# EAGLE design CANSplitter (EAGLE 9.6.2)
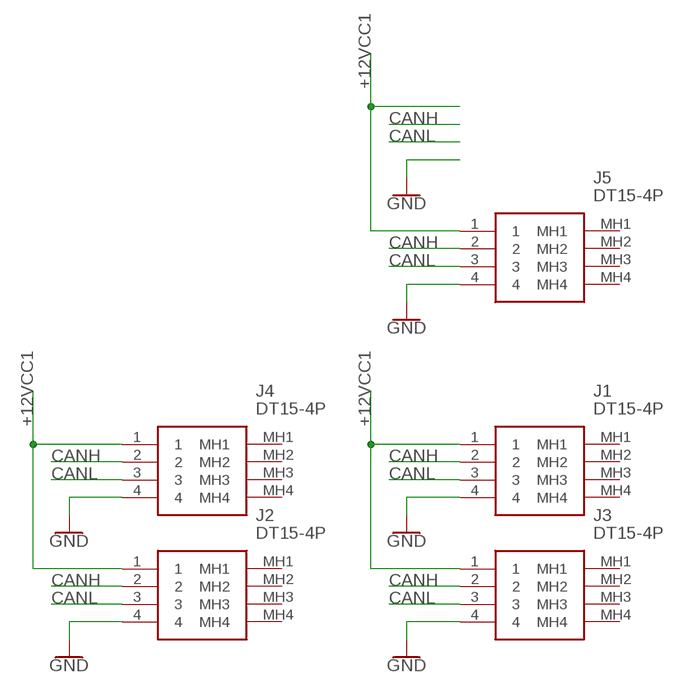
[diagram p0: schematic, sheet 1]

## Parts
J1  DT15-4P  [DT154P]
J2  DT15-4P  [DT154P]
J3  DT15-4P  [DT154P]
J4  DT15-4P  [DT154P]
J5  DT15-4P  [DT154P]

## Nets
+12VCC1: J1.1 J2.1 J3.1 J4.1 J5.1
CANH: J1.2 J2.2 J3.2 J4.2 J5.2
CANL: J1.3 J2.3 J3.3 J4.3 J5.3
GND: J1.4 J2.4 J3.4 J4.4 J5.4
Unconnected: J1.MH1 J1.MH2 J1.MH3 J1.MH4 J2.MH1 J2.MH2 J2.MH3 J2.MH4 J3.MH1 J3.MH2 J3.MH3 J3.MH4 J4.MH1 J4.MH2 J4.MH3 J4.MH4 J5.MH1 J5.MH2 J5.MH3 J5.MH4

## Library data of the parts
J1-J5 = DT15-4P:DT15-4P: Deutsch DT15 Series, 4.44mm Pitch 4 Way 2 Row Straight PCB Header, Solder Termination Source: Datasheet <https://www.te.com/commerce/DocumentDelivery/DDEController?Action=showdoc&DocId=Customer DrawingDT15-4PD2pdfEnglishENG_CD_DT15-4P_D2.pdfDT15-4P>; DESCRIPTION: Deutsch DT15 Series, 4.44mm Pitch 4 Way 2 Row Straight PCB Header, Solder Termination; HEIGHT: 30.35mm; MANUFACTURER_NAME: TE Connectivity; MANUFACTURER_PART_NUMBER: DT15-4P; MOUSER_PART_NUMBER: 571-DT15-4P; MOUSER_PRICE-STOCK: https://www.mouser.co.uk/ProductDetail/TE-Connectivity-DEUTSCH/DT15-4P?qs=vkMqrgFpRajtjo1r4fVe%2Fw%3D%3D

## Net classes
0 default: width 0.305 mm

## Board
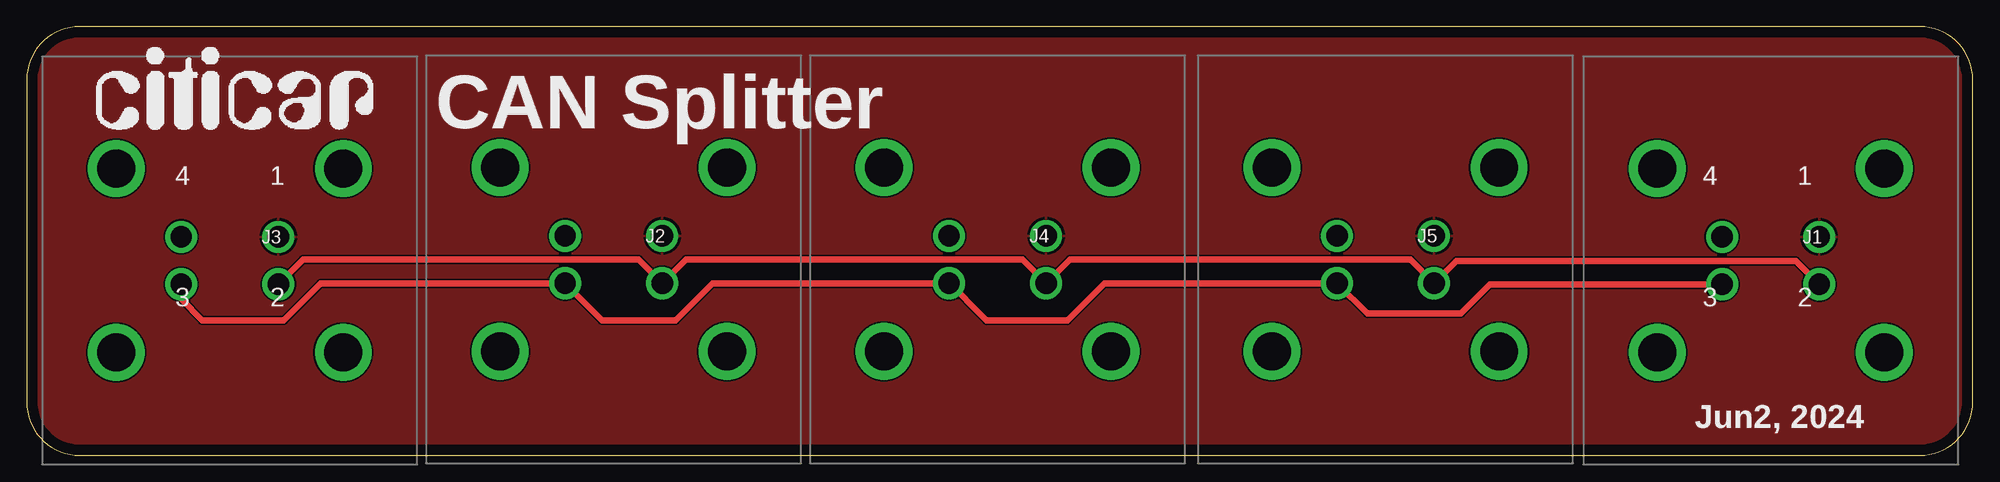
[diagram p1: board, top side]
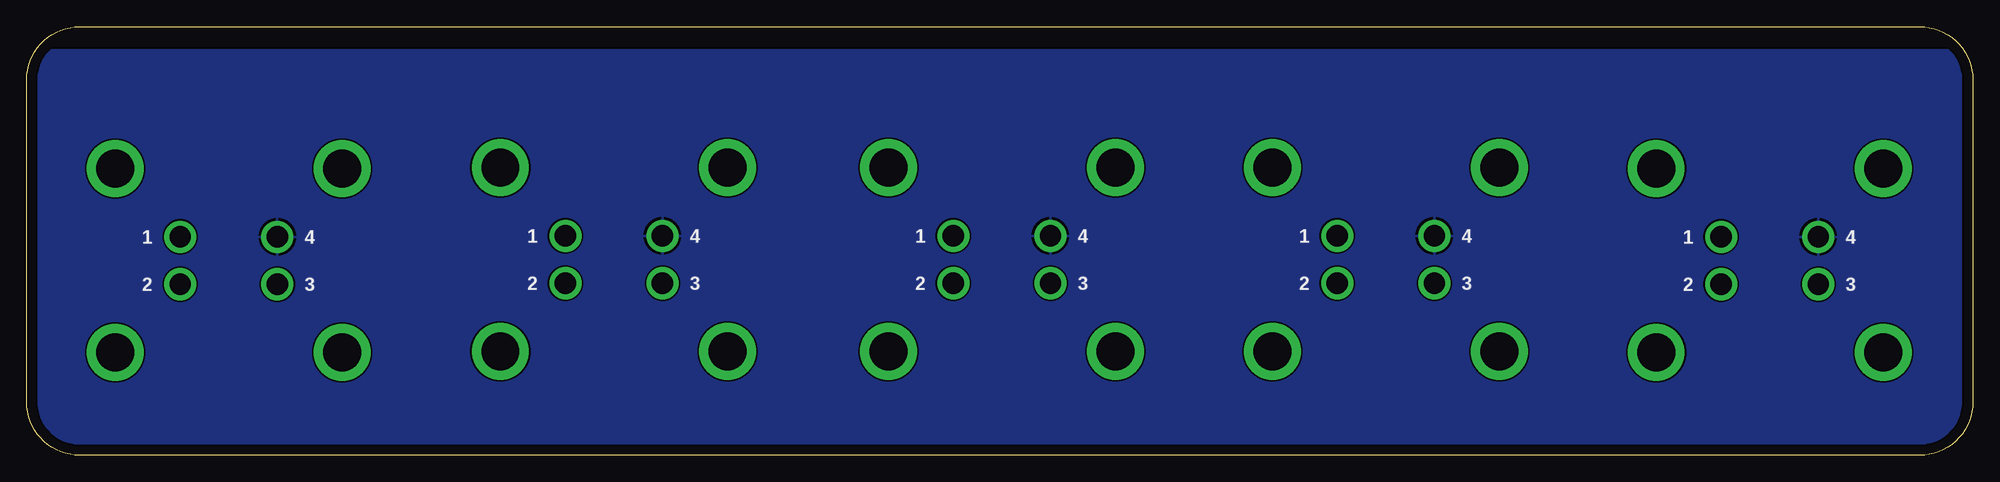
[diagram p2: board, bottom side, seen from below]

Size 182.86 x 40.31 mm. Coordinates in mm from the lower left corner, seen from the top.
Outline: 0,35.31 0,5 arc90 5,0 177.86,0 arc90 182.86,5 182.86,35.31 arc90 177.86,40.31 5,40.31 arc90 0,35.31
Copper layers (1*16): Top 0.035mm / dielectric 1.5mm / Bottom 0.035mm
Design rules "default": minimum track width 6mil, minimum drill 0.35mm, track to track 6mil, track to pad 6mil, pad to pad 6mil, via to via 6mil, smd to smd 6mil, copper to edge 40mil, drill to drill 6mil, minimum pad ring 10mil, minimum via ring 8mil, stop-mask expansion 4mil, vias tented up to drill 0mil, thermal gap 10mil

### Footprints (pad centres in the part's own frame; a part is rotated, then mirrored left to right if it is on the bottom)
DT154P = drill 2.01 pad 3.015: 1 4.599,2.215; 2 4.599,-2.235; 3 -4.521,-2.235; 4 -4.521,2.215 | drill 3.56 pad 5.34: MH1 -10.631,-8.66; MH2 -10.631,8.64; MH3 10.709,8.64; MH4 10.709,-8.66

### Placement (x,y rotation side)
J1  163.83,18.32 0 top
J2  55.12,18.41 0 top
J3  19.05,18.32 0 top
J4  91.19,18.41 0 top
J5  127.63,18.41 0 top

### Tracks (layer width: path | path; a pad name or v marks a point on that pad's centre or on a via)
+12VCC1
  pour Top: 0,40.64 0,0 182.88,0 182.88,40.64
CANH
  Top 0.61: J3.2 25.98,18.41 57.48,18.41 J2.2 61.95,18.41 93.55,18.41 J4.2 98.02,18.41 130,18.41 J5.2 134.34,18.29 166.23,18.29 J1.2
CANL
  Top 0.61: J1.3 137.5,16.09 134.75,13.33 125.96,13.33 J5.3 101.27,16.18 97.79,12.7 90.17,12.7 86.36,16.51 86.36,16.48 J4.3 64.44,16.18 60.96,12.7 54.08,12.7 J2.3 27.61,16.18 24.13,12.7 16.51,12.7 14.53,14.68 J3.3
GND
  pour Bottom: 0,38.1 0,-2.54 182.88,-2.54 182.88,38.1

### Text on the board
tPlace: CAN Splitter | 4 | 1 | 4 | 1 | 3 | 2 | 3 | 2 | Jun2, 2024